# Altium schematic sheet MCU.SchDoc
size A4; DocumentNumber: 3; SheetNumber: 3; SheetTotal: 6; sheetTitle: MCU
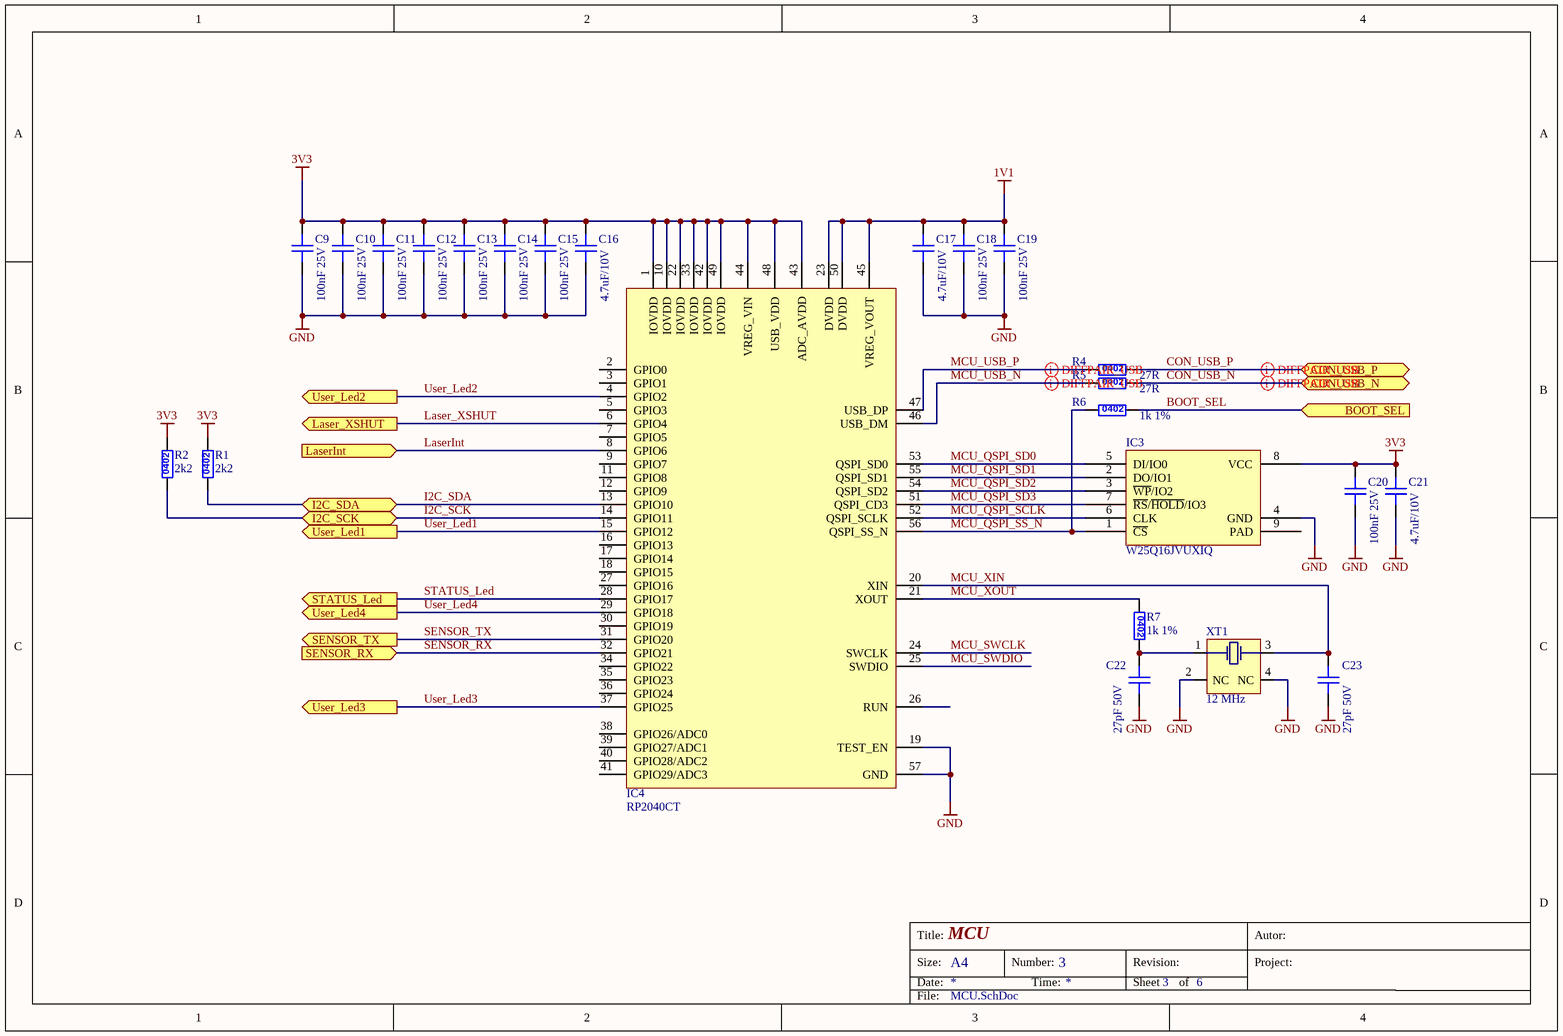
[diagram p0: MCU.SchDoc]

## Parts
C9  value 100nF 25V  [C0402]  (hidden comment: UniversalCapacitor)
C10  value 100nF 25V  [C0402]  (hidden comment: UniversalCapacitor)
C11  value 100nF 25V  [C0402]  (hidden comment: UniversalCapacitor)
C12  value 100nF 25V  [C0402]  (hidden comment: UniversalCapacitor)
C13  value 100nF 25V  [C0402]  (hidden comment: UniversalCapacitor)
C14  value 100nF 25V  [C0402]  (hidden comment: UniversalCapacitor)
C15  value 100nF 25V  [C0402]  (hidden comment: UniversalCapacitor)
C16  4.7uF/10V  [C0402_big]
C17  4.7uF/10V  [C0402_big]
C18  value 100nF 25V  [C0402]  (hidden comment: UniversalCapacitor)
C19  value 100nF 25V  [C0402]  (hidden comment: UniversalCapacitor)
C20  value 100nF 25V  [C0402]  (hidden comment: UniversalCapacitor)
C21  4.7uF/10V  [C0402_big]
C22  value 27pF 50V  [C0402]  (hidden comment: UniversalCapacitor)
C23  value 27pF 50V  [C0402]  (hidden comment: UniversalCapacitor)
IC3  value W25Q16JVUXIQ  [USON-8_3x2]  (hidden comment: W25Q16JV)
IC4  value RP2040CT  [QFN56]  (hidden comment: RP2040)
R1  value 2k2  [R0402]  (hidden comment: UniversalResistor0402)
R2  value 2k2  [R0402]  (hidden comment: UniversalResistor0402)
R4  value 27R  [R0402]  (hidden comment: UniversalResistor0402)
R5  value 27R  [R0402]  (hidden comment: UniversalResistor0402)
R6  value 1k 1%  [R0402]  (hidden comment: UniversalResistor0402)
R7  value 1k 1%  [R0402]  (hidden comment: UniversalResistor0402)
XT1  value 12 MHz  [ABM8]  (hidden comment: XTAL-4Pads-2Used)

## Ports
BOOT_SEL (in), CON_USB_N (bidir), CON_USB_P (bidir), I2C_SCK (bidir), I2C_SDA (bidir), Laser_XSHUT (out), LaserInt (in), SENSOR_RX (in), SENSOR_TX (out), STATUS_Led (out), User_Led1 (out), User_Led2 (out), User_Led3 (out), User_Led4 (out)

## Nets
1V1: C17.1 C18.2 C19.2 IC4.23(DVDD) IC4.45(VREG_VOUT) IC4.50(DVDD)
3V3: C9.2 C10.2 C11.2 C12.2 C13.2 C14.2 C15.2 C16.1 C20.2 C21.1 IC3.8(VCC) IC4.1(IOVDD) IC4.10(IOVDD) IC4.22(IOVDD) IC4.33(IOVDD) IC4.42(IOVDD) IC4.43(ADC_AVDD) IC4.44(VREG_VIN) IC4.48(USB_VDD) IC4.49(IOVDD) R1.1 R2.1
GND: C9.1 C10.1 C11.1 C12.1 C13.1 C14.1 C15.1 C16.2 C17.2 C18.1 C19.1 C20.1 C21.2 C22.2 C23.2 IC3.4(GND) IC4.19(TEST_EN) IC4.57(GND) XT1.2(NC) XT1.4(NC)
BOOT_SEL: R6.1 ; port BOOT_SEL
CON_USB_N: R5.1 ; port CON_USB_N
CON_USB_P: R4.1 ; port CON_USB_P
I2C_SCK: IC4.14(GPIO11) R2.2 ; port I2C_SCK
I2C_SDA: IC4.13(GPIO10) R1.2 ; port I2C_SDA
Laser_XSHUT: IC4.6(GPIO4) ; port Laser_XSHUT
LaserInt: IC4.8(GPIO6) ; port LaserInt
MCU_QSPI_SCLK: IC3.6(CLK) IC4.52(QSPI_SCLK)
MCU_QSPI_SD0: IC3.5(DI/IO0) IC4.53(QSPI_SD0)
MCU_QSPI_SD1: IC3.2(DO/IO1) IC4.55(QSPI_SD1)
MCU_QSPI_SD2: IC3.3(~{WP}/IO2) IC4.54(QSPI_SD2)
MCU_QSPI_SD3: IC3.7(~{RS}/~{HOLD}/IO3) IC4.51(QSPI_CD3)
MCU_QSPI_SS_N: IC3.1(~{CS}) IC4.56(QSPI_SS_N) R6.2
MCU_SWCLK: IC4.24(SWCLK)
MCU_SWDIO: IC4.25(SWDIO)
MCU_USB_N: IC4.46(USB_DM) R5.2
MCU_USB_P: IC4.47(USB_DP) R4.2
MCU_XIN: C23.1 IC4.20(XIN) XT1.3
MCU_XOUT: IC4.21(XOUT) R7.2
SENSOR_RX: IC4.32(GPIO21) ; port SENSOR_RX
SENSOR_TX: IC4.31(GPIO20) ; port SENSOR_TX
STATUS_Led: IC4.28(GPIO17) ; port STATUS_Led
User_Led1: IC4.15(GPIO12) ; port User_Led1
User_Led2: IC4.4(GPIO2) ; port User_Led2
User_Led3: IC4.37(GPIO25) ; port User_Led3
User_Led4: IC4.29(GPIO18) ; port User_Led4
NetC22_1: C22.1 R7.1 XT1.1

Not connected (* = marked no-connect by the designer): IC3 9(PAD); IC4 2(GPIO0) 3(GPIO1) 5(GPIO3) 7(GPIO5) 9(GPIO7) 11(GPIO8) 12(GPIO9) 16(GPIO13) 17(GPIO14) 18(GPIO15) 26(RUN) 27(GPIO16) 30(GPIO19) 34(GPIO22) 35(GPIO23) 36(GPIO24) 38(GPIO26/ADC0) 39(GPIO27/ADC1) 40(GPIO28/ADC2) 41(GPIO29/ADC3)

## Layout directives
differential pair; differential pair class diff_90ohm; net class single_50ohm; Parameter 1: DIFF_USB: CON_USB_N, CON_USB_P, MCU_USB_N, MCU_USB_P

## Notes on the sheet
- Title:
- Size:
- Date:
- A4
- Number:
- Time:
- Revision:
- Sheet
- of
- Autor:
- Project:
- File:
- (in symbol CRCW04021K00FKED) 0402
- (in symbol CRCW04022K20FKED) 0402
- (in symbol CRCW040227R0FKED) 0402

## Library data of the parts
C9-C15 C18-C20 = 0402B104K250CT: WALSIN - 0402B104K250CT - CAPACITOR, MLCC, X7R, 0.1UF, 25V, 0402; part_id: 2099; name: 0402B104K250CT; Supplier 1: Farnell; Supplier Part Number 1: 2496772; ComponentLink1URL: http://cz.farnell.com/2496772?Ntt=2496772; HelpURL: http://www.farnell.com/datasheets/2340522.pdf; footprint_name: C0402; schematic_name: UniversalCapacitor
C16 C17 C21 = GRM155R61A475MEAAD: MURATA - GRM155R61A475MEAAD - CAP, MLCC, X5R, 4.7UF, 10V, 0402; part_id: 2175; Value: 4.7uF/10V; name: GRM155R61A475MEAAD; Supplier 1: Farnell; Supplier Part Number 1: 2688503; ComponentLink1URL: http://cz.farnell.com/2688503?Ntt=2688503; HelpURL: http://www.farnell.com/datasheets/2189109.pdf; footprint_name: C0402_big; schematic_name: UniversalCapacitor
C22 C23 = 0402N270J500CT: WALSIN - 0402N270J500CT - CAPACITOR, MLCC, NP0, 27PF, 50V, 0402; part_id: 2100; name: 0402N270J500CT; Supplier 1: Farnell; Supplier Part Number 1: 2496801; ComponentLink1URL: http://cz.farnell.com/2496801?Ntt=2496801; HelpURL: http://www.farnell.com/datasheets/2340522.pdf; footprint_name: C0402; schematic_name: UniversalCapacitor
IC3 = W25Q16JVUXIQ: Flash NOR spiFlash, 3V, 16M-bit, 4Kb Uniform Sector, DTR; part_id: 2967; name: W25Q16JVUXIQ; Supplier 1: Mouser; Supplier Part Number 1: 454-W25Q16JVUXIQTR; ComponentLink1URL: https://cz.mouser.com/ProductDetail/Winbond/W25Q16JVUXIQ-TR?qs=qSfuJ%252Bfl%2Fd7SDdIHLGOd1g%3D%3D; HelpURL: https://cz.mouser.com/datasheet/2/949/w25q16jv_spi_revg_03222018_plus-1489727.pdf; footprint_name: USON-8_3x2; schematic_name: W25Q16JVUXIQ
IC4 = RP2040CT: RASPBERRY-PI - RP2040CT - ARM MCU, RP2040 Series Microcontrollers, ARM Cortex-M0+, 32bit, 133 MHz, 16 MB, 264 KB; part_id: 2966; name: RP2040CT; Supplier 1: Farnell; Supplier Part Number 1: 3766082; ComponentLink1URL: http://cz.farnell.com/3766082?Ntt=3766082; HelpURL: http://www.farnell.com/datasheets/3213406.pdf; footprint_name: QFN56; schematic_name: RP2040
R1 R2 = CRCW04022K20FKED: VISHAY - CRCW04022K20FKED. - RES, THICK FILM, 2K2, 1%, 0.063W, 0402; part_id: 2177; name: CRCW04022K20FKED; Supplier 1: Farnell; Supplier Part Number 1: 2140802; ComponentLink1URL: http://cz.farnell.com/2140802?Ntt=2140802; HelpURL: http://www.farnell.com/datasheets/2310790.pdf; footprint_name: R0402; schematic_name: UniversalResistor0402
R4 R5 = CRCW040227R0FKED: VISHAY - CRCW040227R0FKED. - SMD Chip Resistor, 27 ohm, ± 1%, 62.5 mW, 0402 [1005 Metric], Thick Film, General Purpose; part_id: 2830; name: CRCW040227R0FKED; Supplier 1: Farnell; Supplier Part Number 1: 2140614; ComponentLink1URL: http://cz.farnell.com/2140614?Ntt=2140614; HelpURL: http://www.farnell.com/datasheets/2310790.pdf; footprint_name: R0402; schematic_name: UniversalResistor0402
R6 R7 = CRCW04021K00FKED: VISHAY - CRCW04021K00FKED - RES, THICK FILM, 1K, 1%, 0.063W, 0402; part_id: 2180; name: CRCW04021K00FKED; Supplier 1: Farnell; Supplier Part Number 1: 1469662; ComponentLink1URL: http://cz.farnell.com/1469662?Ntt=1469662; HelpURL: http://www.farnell.com/datasheets/2310790.pdf; footprint_name: R0402; schematic_name: UniversalResistor0402
XT1 = ABM8-12.000MHZ-B2-T: Krystaly 12.0 MHZ 18PF 20PPM 120OHM; part_id: 1039; name: ABM8-12.000MHZ-B2-T; Supplier 1: Mouser; Supplier Part Number 1: 815-ABM8-12-B2-T; ComponentLink1URL: https://cz.mouser.com/ProductDetail/ABRACON/ABM8-12.000MHZ-B2-T?qs=hjiqo2PPvpiyy6%252BNWm3IZg%3D%3D; HelpURL: https://cz.mouser.com/datasheet/2/3/abm8-1384678.pdf; footprint_name: ABM8; schematic_name: XTAL-4Pads-2Used